# Altium schematic sheet ZENDER.SchDoc
size A4
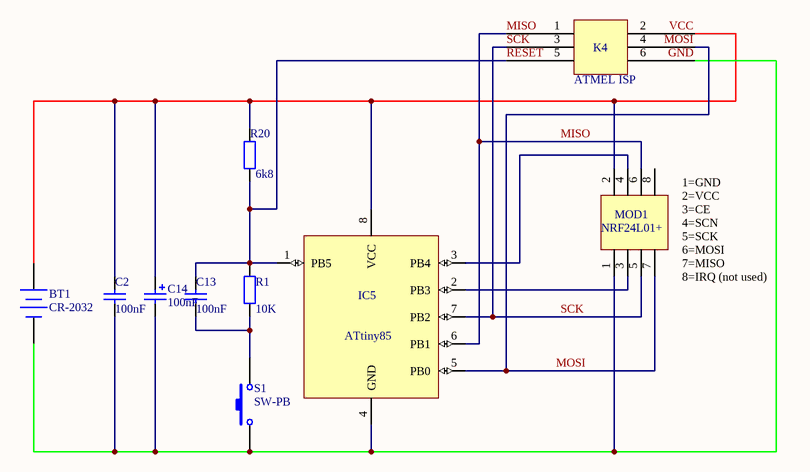
[diagram p0: ZENDER.SchDoc]

## Parts
BT1  CR-2032  [PANA-CR-2032HFN]
C2  value 100nF  [C1206]  (hidden comment: Cap Semi)
C13  value 100nF  [C1206]  (hidden comment: Cap Semi)
C14  value 100nF  [POLAR0.8]  (hidden comment: Cap Pol2)
IC5  ATtiny85  [*SOIC127P798X216-8N]
K4  ATMEL ISP  [HDR2X3]
MOD1  NRF24L01+  [HDR2X4]
R1  value 10K  [*RESC3115X70N]  (hidden comment: Res2)
R20  value 6k8  [*RESC3216X55N]  (hidden comment: Res2)
S1  SW-PB  [SPST-2]

## Nets
NetBT1_1: BT1.1(+) C2.2 C14.1 IC5.8(VCC) K4.2 MOD1.2 R20.1
NetBT1_2: BT1.2(-) C2.1 C14.2 IC5.4(GND) K4.6 MOD1.1 S1.1
NetC13_1: C13.1 R1.2 S1.2
NetC13_2: C13.2 IC5.1(PB5) K4.5 R1.1 R20.2
NetIC5_2: IC5.2(PB3) MOD1.3
NetIC5_3: IC5.3(PB4) MOD1.4
NetIC5_5: IC5.5(PB0) K4.4 MOD1.7
NetIC5_6: IC5.6(PB1) K4.1 MOD1.6
NetIC5_7: IC5.7(PB2) K4.3 MOD1.5

Not connected (* = marked no-connect by the designer): MOD1 8

## Notes on the sheet
- (near K4) MISO
- (near K4) SCK
- (near K4) RESET
- (near K4) VCC
- (near K4) MOSI
- (near K4) GND
- MISO
- (near MOD1) 1=GND
- (near MOD1) 2=VCC
- (near MOD1) 3=CE
- (near MOD1) 4=SCN
- (near MOD1) 5=SCK
- (near MOD1) 6=MOSI
- (near MOD1) 7=MISO
- SCK
- (near MOD1) 8=IRQ (not used)
- MOSI

## Library data of the parts
BT1 = CMP-2000-05296-1: Coin Cell Battery, 225 mAh, 0.2 mA, 3 V, -30 to 60 degC, Bulk; Manufacturer: Panasonic; SVHC: 1,2-dimethoxyethane,ethyleneglycoldimethylether(EGDME)(15-Jun-2015); Battery Size Code: 2032; Battery Voltage: 3V; Battery IEC Code: CR2032; Battery NEDA Code: 5004LC; External Height: 3.2mm; Battery Terminals: PCBPins; Battery Capacity: 220mAh; External Diameter: 20mm; Battery Technology: LithiumManganeseDioxide; Product Range: -; Datasheet Version: Rev. 0, 05/2010; Manufacturer URL: http://www.panasonic.com/; External Depth: -; Weight: 2.9g; Datasheet URL: https://datasheet.ciiva.com/3/aaa4000de87-3072.pdf; External Width: -
C2 C13 = Cap Semi: Capacitor (Semiconductor SIM Model); Published: 8-Jun-2000; LatestRevisionDate: 29-May-2009; LatestRevisionNote: IPC-7351 Footprint Added.; PackageReference: C1206; Publisher: Altium Limited; PackageDescription: Chip Capacitor
C14 = Cap Pol2: Polarized Capacitor (Axial); Published: 8-Jun-2000; LatestRevisionDate: 17-Jul-2002; LatestRevisionNote: Re-released for DXP Platform.; PackageReference: POLAR0.8; Publisher: Altium Limited; PackageDescription: Polarized Capacitor; 2 Leads
IC5 = CMP-0093-00032-2: 8-bit AVR Microcontroller, 20MHz, 2.7-5.5V, 8K Flash, 512 Bytes EEPROM, 512 Bytes SRAM, Industrial Grade (-40°C to 85°C), 8-Lead PDIP, Pb-Free; Manufacturer: Microchip / Atmel; Manufacturer Part Number: ATTINY85-20PU; PackageVersion: revB, Jan-2002; ComponentLink2URL: http://www.atmel.com/dyn/resources/prod_documents/doc2586.pdf; PackageReference: 8P3; ComponentLink2Description: ATtiny25/45/85 Datasheet; ComponentLink3Description: ATtiny25/45/85 Summary; ComponentLink3URL: http://www.atmel.com/dyn/resources/prod_documents/2586S.pdf; RevisionNote: DatasheetVersion updated. URLs added.; DatasheetVersion: revN, Apr-2011; ComponentLink1Description: Manufacturer URL; Code_JEDEC: MS-001-BA; ComponentLink1URL: http://www.atmel.com/; PackageDescription: 8-Lead, 0.300" Wide Body, Plastic Dual In-Line Package (PDIP)
K4 = Header 3X2: Header, 3-Pin, Dual row; LatestRevisionDate: 17-Jul-2002; LatestRevisionNote: Re-released for DXP Platform.; Publisher: Altium Limited
MOD1 = Header 4X2: Header, 4-Pin, Dual row; LatestRevisionDate: 17-Jul-2002; LatestRevisionNote: Re-released for DXP Platform.; Publisher: Altium Limited
R1 R20 = Res2: Resistor; Published: 8-Jun-2000; LatestRevisionDate: 17-Jul-2002; LatestRevisionNote: Re-released for DXP Platform.; PackageReference: AXIAL-0.4; Publisher: Altium Limited; PackageDescription: Axial Device, Thru-Hole; 2 Leads; 0.4 in Pin Spacing
S1 = SW-PB: Switch; Published: 24-Mar-1999; LatestRevisionDate: 17-Jul-2002; LatestRevisionNote: Re-released for DXP Platform.; PackageReference: SPST-2; Publisher: Altium Limited; PackageDescription: Switch; 2 Leads